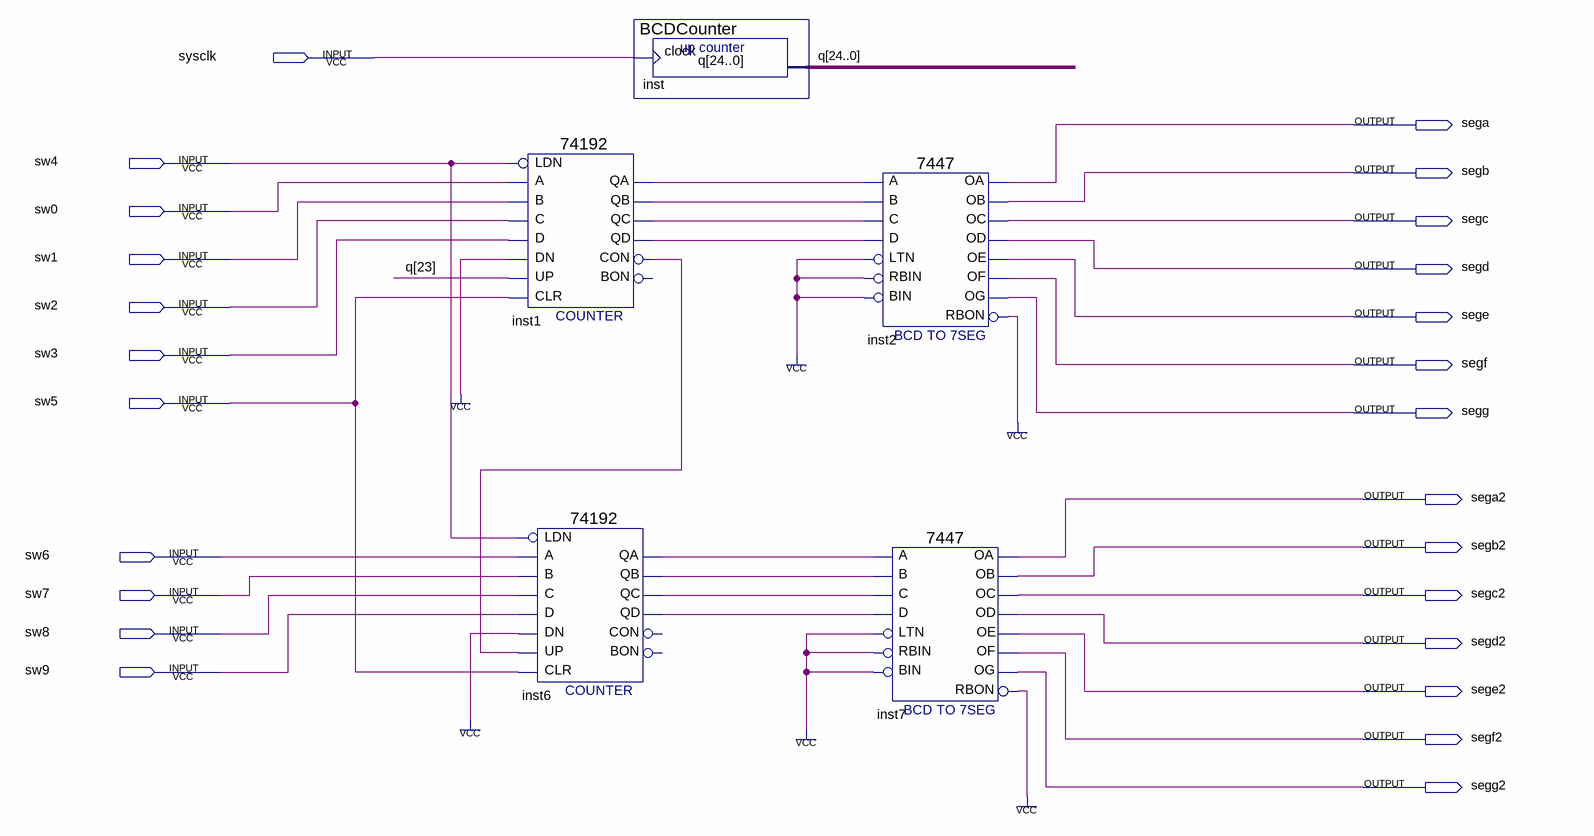
[diagram p0: schematic sheet]
// Quartus schematic Synchronous_BCD_Counter.bdf as structural Verilog: 5 symbols, 25 pins
module Synchronous_BCD_Counter (
  input  sysclk,
  input  sw4,
  input  sw0,
  input  sw1,
  input  sw2,
  input  sw3,
  input  sw5,
  input  sw6,
  input  sw7,
  input  sw8,
  input  sw9,
  output sega,
  output segb,
  output segc,
  output segd,
  output sege,
  output segf,
  output segg,
  output sega2,
  output segb2,
  output segc2,
  output segd2,
  output sege2,
  output segf2,
  output segg2
);

  wire inst1_con, inst1_qa, inst1_qb, inst1_qc, inst1_qd, inst2_rbon, inst6_qa, inst6_qb, inst6_qc, inst6_qd,
       inst7_rbon;
  wire [24:0] q;

  \74192  inst1 (
    .D(sw3), .C(sw2), .A(sw0), .B(sw1), .CLR(sw5), .UP(q[23]), .DN(1'b1), .LDN(sw4), .QB(inst1_qb),
    .CON(inst1_con), .QA(inst1_qa), .QC(inst1_qc), .QD(inst1_qd));  // open: BON
  \74192  inst6 (
    .D(sw9), .C(sw8), .A(sw6), .B(sw7), .CLR(sw5), .UP(inst1_con), .DN(1'b1), .LDN(sw4), .QB(inst6_qb),
    .QA(inst6_qa), .QC(inst6_qc), .QD(inst6_qd));  // open: BON, CON
  BCDCounter inst (.clock(sysclk), .q(q));
  \7447  inst2 (
    .LTN(1'b1), .B(inst1_qb), .C(inst1_qc), .D(inst1_qd), .RBIN(1'b1), .BIN(1'b1), .A(inst1_qa), .OB(segb),
    .OC(segc), .OE(sege), .OD(segd), .OF(segf), .OG(segg), .OA(sega), .RBON(inst2_rbon));
  \7447  inst7 (
    .LTN(1'b1), .B(inst6_qb), .C(inst6_qc), .D(inst6_qd), .RBIN(1'b1), .BIN(1'b1), .A(inst6_qa), .OB(segb2),
    .OC(segc2), .OE(sege2), .OD(segd2), .OF(segf2), .OG(segg2), .OA(sega2), .RBON(inst7_rbon));
  // also tied to VCC on the sheet: {inst2_rbon, inst7_rbon}
endmodule
